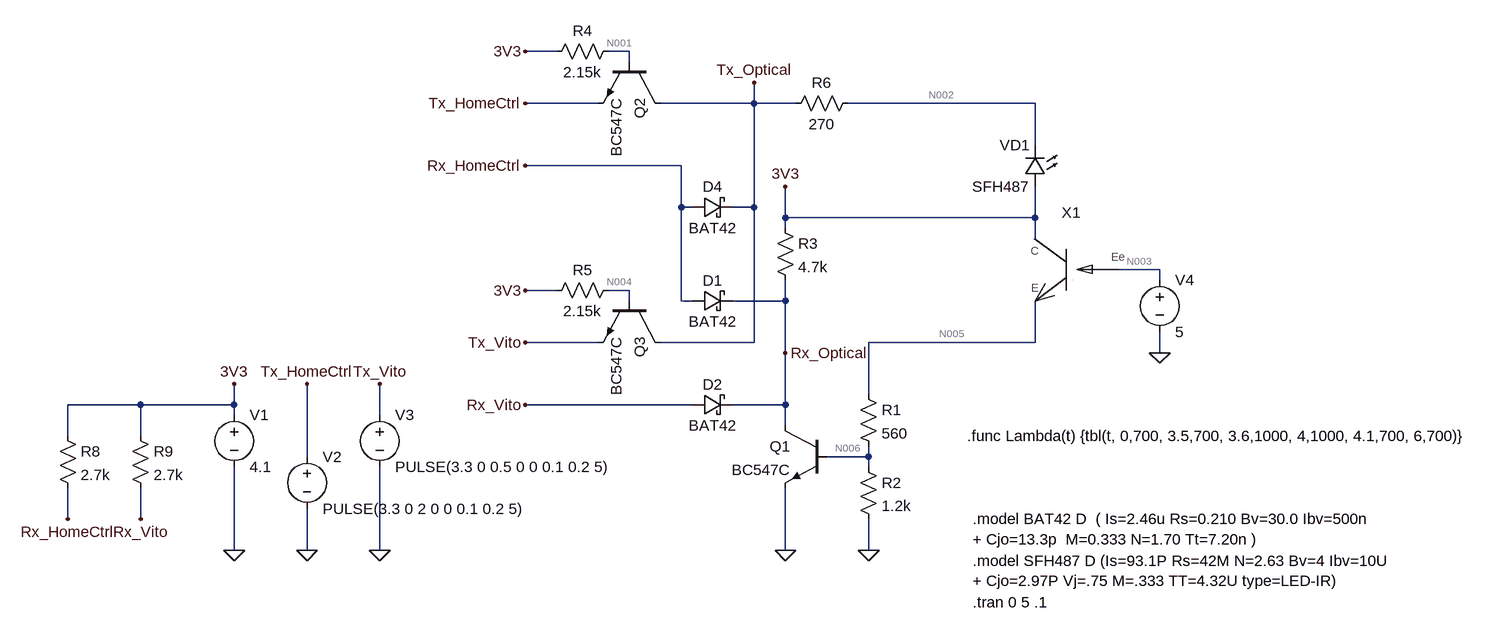
[diagram p0: schematic OptolinkDuo_op.asc]
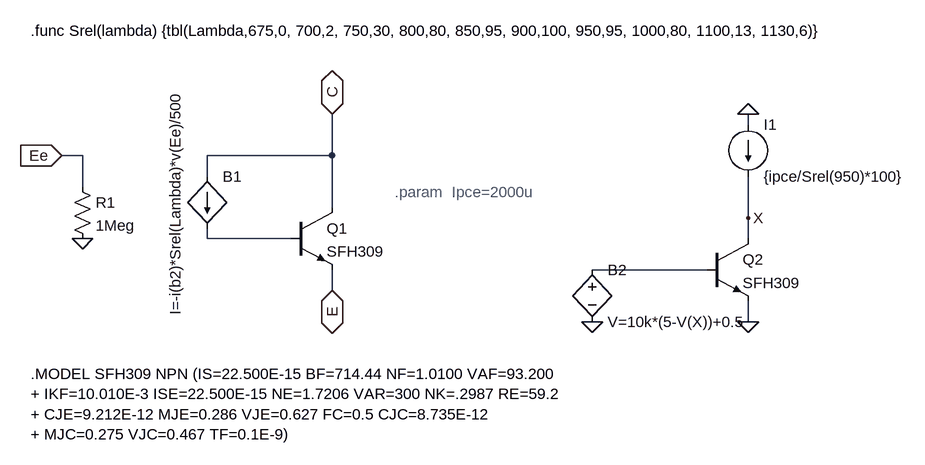
[diagram p1: sub-circuit sfh309fa.asc]
OptolinkDuo_op.asc, the LTspice schematic file:
Version 4
SHEET 1 1868 680
WIRE -256 -1344 -304 -1344
WIRE -144 -1344 -176 -1344
WIRE -144 -1328 -144 -1344
WIRE -192 -1264 -304 -1264
WIRE 48 -1264 48 -1296
WIRE 48 -1264 -96 -1264
WIRE 112 -1264 48 -1264
WIRE 480 -1264 192 -1264
WIRE 480 -1200 480 -1264
WIRE -64 -1168 -304 -1168
WIRE -64 -1104 -64 -1168
WIRE -48 -1104 -64 -1104
WIRE 48 -1104 48 -1264
WIRE 48 -1104 16 -1104
WIRE 96 -1088 96 -1136
WIRE 480 -1088 480 -1136
WIRE 480 -1088 96 -1088
WIRE 96 -1072 96 -1088
WIRE 480 -1056 480 -1088
WIRE 672 -1008 608 -1008
WIRE 672 -992 672 -1008
WIRE -256 -976 -304 -976
WIRE -144 -976 -176 -976
WIRE -144 -960 -144 -976
WIRE -64 -960 -64 -1104
WIRE -48 -960 -64 -960
WIRE 96 -960 96 -992
WIRE 96 -960 16 -960
WIRE -192 -896 -304 -896
WIRE 48 -896 48 -1104
WIRE 48 -896 -96 -896
WIRE 480 -896 480 -960
WIRE 480 -896 224 -896
WIRE 96 -880 96 -960
WIRE 672 -880 672 -912
WIRE 224 -816 224 -896
WIRE -896 -800 -1008 -800
WIRE -752 -800 -752 -832
WIRE -752 -800 -896 -800
WIRE -48 -800 -304 -800
WIRE 96 -800 96 -880
WIRE 96 -800 16 -800
WIRE -752 -784 -752 -800
WIRE -528 -784 -528 -832
WIRE 96 -768 96 -800
WIRE -1008 -752 -1008 -800
WIRE -896 -752 -896 -800
WIRE -640 -720 -640 -832
WIRE 224 -720 224 -736
WIRE 224 -720 160 -720
WIRE 224 -704 224 -720
WIRE -1008 -624 -1008 -672
WIRE -896 -624 -896 -672
WIRE -752 -576 -752 -704
WIRE -640 -576 -640 -640
WIRE -528 -576 -528 -704
WIRE 96 -576 96 -672
WIRE 224 -576 224 -624
FLAG 224 -576 0
FLAG 96 -576 0
FLAG -304 -800 Rx_Vito
FLAG -304 -1168 Rx_HomeCtrl
FLAG -304 -1264 Tx_HomeCtrl
FLAG -304 -896 Tx_Vito
FLAG -304 -976 3V3
FLAG -304 -1344 3V3
FLAG -640 -576 0
FLAG -528 -576 0
FLAG -752 -576 0
FLAG -752 -832 3V3
FLAG -528 -832 Tx_Vito
FLAG -640 -832 Tx_HomeCtrl
FLAG 96 -1136 3V3
FLAG 48 -1296 Tx_Optical
FLAG 96 -880 Rx_Optical
FLAG -1008 -624 Rx_HomeCtrl
FLAG -896 -624 Rx_Vito
FLAG 672 -880 0
SYMBOL res 208 -832 R0
SYMATTR InstName R1
SYMATTR Value 560
SYMBOL res 208 -720 R0
SYMATTR InstName R2
SYMATTR Value 1.2k
SYMBOL npn 160 -768 M0
SYMATTR InstName Q1
SYMATTR Value BC547C
SYMBOL npn -96 -960 R90
SYMATTR InstName Q3
SYMATTR Value BC547C
SYMBOL schottky -48 -944 R270
WINDOW 0 32 32 VTop 2
WINDOW 3 0 32 VBottom 2
SYMATTR InstName D1
SYMATTR Value BAT42
SYMBOL schottky -48 -784 R270
WINDOW 0 32 32 VTop 2
WINDOW 3 0 32 VBottom 2
SYMATTR InstName D2
SYMATTR Value BAT42
SYMBOL res -160 -992 R90
WINDOW 0 0 56 VBottom 2
WINDOW 3 32 56 VTop 2
SYMATTR InstName R5
SYMATTR Value 2.15k
SYMBOL npn -96 -1328 R90
SYMATTR InstName Q2
SYMATTR Value BC547C
SYMBOL res -160 -1360 R90
WINDOW 0 0 56 VBottom 2
WINDOW 3 32 56 VTop 2
SYMATTR InstName R4
SYMATTR Value 2.15k
SYMBOL res 208 -1280 R90
WINDOW 0 0 56 VBottom 2
WINDOW 3 32 56 VTop 2
SYMATTR InstName R6
SYMATTR Value 270
SYMBOL LED 496 -1136 R180
WINDOW 0 24 64 Left 2
WINDOW 3 24 0 Left 2
SYMATTR InstName VD1
SYMATTR Value SFH487
SYMBOL res 80 -1088 R0
SYMATTR InstName R3
SYMATTR Value 4.7k
SYMBOL schottky -48 -1088 R270
WINDOW 0 32 32 VTop 2
WINDOW 3 0 32 VBottom 2
SYMATTR InstName D4
SYMATTR Value BAT42
SYMBOL voltage -752 -800 R0
WINDOW 123 0 0 Left 0
WINDOW 39 0 0 Left 0
SYMATTR InstName V1
SYMATTR Value 4.1
SYMBOL voltage -640 -736 R0
WINDOW 123 0 0 Left 0
WINDOW 39 0 0 Left 0
SYMATTR InstName V2
SYMATTR Value PULSE(3.3 0 2 0 0 0.1 0.2 5)
SYMBOL voltage -528 -800 R0
WINDOW 123 0 0 Left 0
WINDOW 39 0 0 Left 0
SYMATTR InstName V3
SYMATTR Value PULSE(3.3 0 0.5 0 0 0.1 0.2 5)
SYMBOL res -1024 -768 R0
SYMATTR InstName R8
SYMATTR Value 2.7k
SYMBOL res -912 -768 R0
SYMATTR InstName R9
SYMATTR Value 2.7k
SYMBOL SFH309FA 544 -1040 M0
SYMATTR InstName X1
SYMBOL voltage 672 -1008 R0
WINDOW 123 0 0 Left 0
WINDOW 39 0 0 Left 0
SYMATTR InstName V4
SYMATTR Value 5
TEXT 384 -496 Left 2 !.tran 0 5 .1
TEXT 384 -624 Left 2 !.model BAT42 D  ( Is=2.46u Rs=0.210 Bv=30.0 Ibv=500n\n+ Cjo=13.3p  M=0.333 N=1.70 Tt=7.20n )
TEXT 384 -560 Left 2 !.model SFH487 D (Is=93.1P Rs=42M N=2.63 Bv=4 Ibv=10U\n+ Cjo=2.97P Vj=.75 M=.333 TT=4.32U type=LED-IR)
TEXT 376 -752 Left 2 !.func Lambda(t) {tbl(t, 0,700, 3.5,700, 3.6,1000, 4,1000, 4.1,700, 6,700)}

sfh309fa.asc, the sub-circuit schematic file:
Version 4
SHEET 1 1664 680
WIRE 864 -384 864 -400
WIRE -160 -336 -192 -336
WIRE 224 -336 224 -400
WIRE 224 -336 32 -336
WIRE 32 -304 32 -336
WIRE -160 -288 -160 -336
WIRE 224 -256 224 -336
WIRE 864 -240 864 -304
WIRE 32 -208 32 -224
WIRE 160 -208 32 -208
WIRE 864 -208 864 -240
WIRE 800 -160 624 -160
WIRE 224 -128 224 -160
WIRE 864 -80 864 -112
FLAG -160 -208 0
FLAG -192 -336 Ee
IOPIN -192 -336 In
FLAG 224 -400 C
IOPIN 224 -400 BiDir
FLAG 224 -128 E
IOPIN 224 -128 BiDir
FLAG 864 -400 0
FLAG 864 -80 0
FLAG 624 -80 0
FLAG 864 -240 X
SYMBOL npn 160 -256 R0
SYMATTR InstName Q1
SYMATTR Value SFH309
SYMBOL bi 32 -304 R0
WINDOW 3 -49 -134 VRight 2
SYMATTR Value I=-i(b2)*Srel(Lambda)*v(Ee)/500
SYMATTR InstName B1
SYMBOL res -176 -304 R0
SYMATTR InstName R1
SYMATTR Value 1Meg
SYMBOL npn 800 -208 R0
SYMATTR InstName Q2
SYMATTR Value SFH309
SYMBOL current 864 -384 R0
SYMATTR InstName I1
SYMATTR Value {ipce/Srel(950)*100}
SYMBOL bv 624 -176 R0
SYMATTR InstName B2
SYMATTR Value V=10k*(5-V(X))+0.5
TEXT -240 0 Left 2 !.MODEL SFH309 NPN (IS=22.500E-15 BF=714.44 NF=1.0100 VAF=93.200\n+ IKF=10.010E-3 ISE=22.500E-15 NE=1.7206 VAR=300 NK=.2987 RE=59.2\n+ CJE=9.212E-12 MJE=0.286 VJE=0.627 FC=0.5 CJC=8.735E-12\n+ MJC=0.275 VJC=0.467 TF=0.1E-9)
TEXT -240 -528 Left 2 !.func Srel(lambda) {tbl(Lambda,675,0, 700,2, 750,30, 800,80, 850,95, 900,100, 950,95, 1000,80, 1100,13, 1130,6)}
TEXT 320 -280 Left 2 ;.param  Ipce=2000u

The netlist it stands for:
* OptolinkDuo_op.asc
R1 N005 N006 560
R2 N006 0 1.2k
Q1 Rx_Optical N006 0 0 BC547C
Q3 Tx_Optical N004 Tx_Vito 0 BC547C
D1 Rx_HomeCtrl Rx_Optical BAT42
D2 Rx_Vito Rx_Optical BAT42
R5 N004 3V3 2.15k
Q2 Tx_Optical N001 Tx_HomeCtrl 0 BC547C
R4 N001 3V3 2.15k
R6 N002 Tx_Optical 270
D§VD1 3V3 N002 SFH487
R3 3V3 Rx_Optical 4.7k
D4 Rx_HomeCtrl Tx_Optical BAT42
V1 3V3 0 4.1
V2 Tx_HomeCtrl 0 PULSE(3.3 0 2 0 0 0.1 0.2 5)
V3 Tx_Vito 0 PULSE(3.3 0 0.5 0 0 0.1 0.2 5)
R8 3V3 Rx_HomeCtrl 2.7k
R9 3V3 Rx_Vito 2.7k
XX1 N003 3V3 N005 sfh309fa
V4 N003 0 5

* block symbol definitions
.subckt sfh309fa Ee C E
Q1 C N001 E 0 SFH309
B1 C N001 I=-i(b2)*Srel(Lambda)*v(Ee)/500
R1 Ee 0 1Meg
Q2 X N002 0 0 SFH309
I1 0 X {ipce/Srel(950)*100}
B2 N002 0 V=10k*(5-V(X))+0.5
.MODEL SFH309 NPN (IS=22.500E-15 BF=714.44 NF=1.0100 VAF=93.200
+ IKF=10.010E-3 ISE=22.500E-15 NE=1.7206 VAR=300 NK=.2987 RE=59.2
+ CJE=9.212E-12 MJE=0.286 VJE=0.627 FC=0.5 CJC=8.735E-12
+ MJC=0.275 VJC=0.467 TF=0.1E-9)
.func Srel(lambda) {tbl(Lambda,675,0, 700,2, 750,30, 800,80, 850,95, 900,100, 950,95, 1000,80, 1100,13, 1130,6)}
* .param  Ipce=2000u
.ends sfh309fa

.model D D
.lib standard.dio
.model NPN NPN
.model PNP PNP
.lib standard.bjt
.tran 0 5 .1
.model BAT42 D  ( Is=2.46u Rs=0.210 Bv=30.0 Ibv=500n
+ Cjo=13.3p  M=0.333 N=1.70 Tt=7.20n )
.model SFH487 D (Is=93.1P Rs=42M N=2.63 Bv=4 Ibv=10U
+ Cjo=2.97P Vj=.75 M=.333 TT=4.32U type=LED-IR)
.func Lambda(t) {tbl(t, 0,700, 3.5,700, 3.6,1000, 4,1000, 4.1,700, 6,700)}
.backanno
.end

* Results of the author's LTspice run, read from the files saved beside the schematic
* Operating Point, zero values left out:
*   V(n005) = 74.86 mV
*   V(n006) = 51.04 mV
*   V(rx_optical) = 4.091 V
*   V(tx_optical) = 3.301 V
*   V(n004) = 3.92 V
*   V(tx_vito) = 3.3 V
*   V(rx_homectrl) = 3.5 V
*   V(rx_vito) = 4.099 V
*   V(3v3) = 4.1 V
*   V(n001) = 3.92 V
*   V(tx_homectrl) = 3.3 V
*   V(n002) = 3.304 V
*   V(n003) = 5 V
*   Ic(Q2) = 117.9 µA
*   Ib(Q2) = 83.93 µA
*   Ie(Q2) = -201.8 µA
*   Ic(Q3) = 117.9 µA
*   Ib(Q3) = 83.93 µA
*   Ie(Q3) = -201.8 µA
*   Ic(Q1) = 4.423 pA
*   Ib(Q1) = -4.009 pA
*   I(Vd1) = 11.2 µA
*   I(D4) = 224.6 µA
*   I(D2) = 487.7 nA
*   I(D1) = -2.46 µA
*   I(R9) = 487.7 nA
*   I(R8) = 222.1 µA
*   I(R3) = 1.972 µA
*   I(R6) = 11.2 µA
*   I(R4) = -83.93 µA
*   I(R5) = -83.93 µA
*   I(R2) = 42.54 µA
*   I(R1) = 42.54 µA
*   I(V4) = -5 µA
*   I(V3) = 201.8 µA
*   I(V2) = 201.8 µA
*   I(V1) = -446.2 µA
*   Ix(x1:EE) = 5 µA
*   Ix(x1:C) = 42.54 µA
*   Ix(x1:E) = -42.54 µA
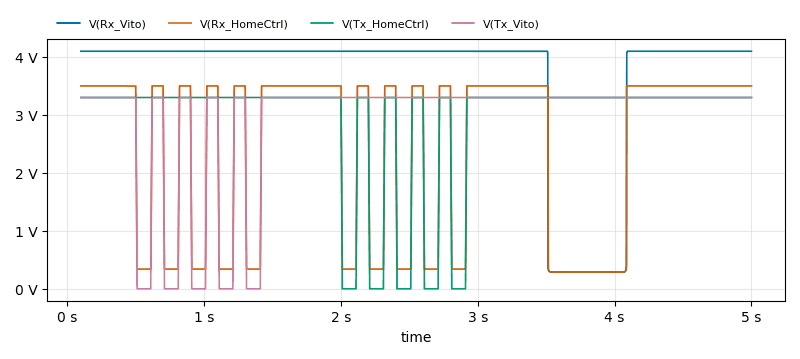
[diagram p2: Transient Analysis of OptolinkDuo_op.asc, plotted from the saved traces]
* Transient Analysis, 1 run:
*   V(Rx_Vito): min 288.6 mV, max 4.099 V, average 3.653 V, rms 3.852 V, last 4.099 V
*   V(Rx_HomeCtrl): min 288.7 mV, max 3.5 V, average 2.417 V, rms 2.836 V, last 3.5 V
*   V(Tx_HomeCtrl): min 0 V, max 3.3 V, average 2.93 V, rms 3.104 V, last 3.3 V
*   V(Tx_Vito): min 0 V, max 3.3 V, average 2.93 V, rms 3.104 V, last 3.3 V